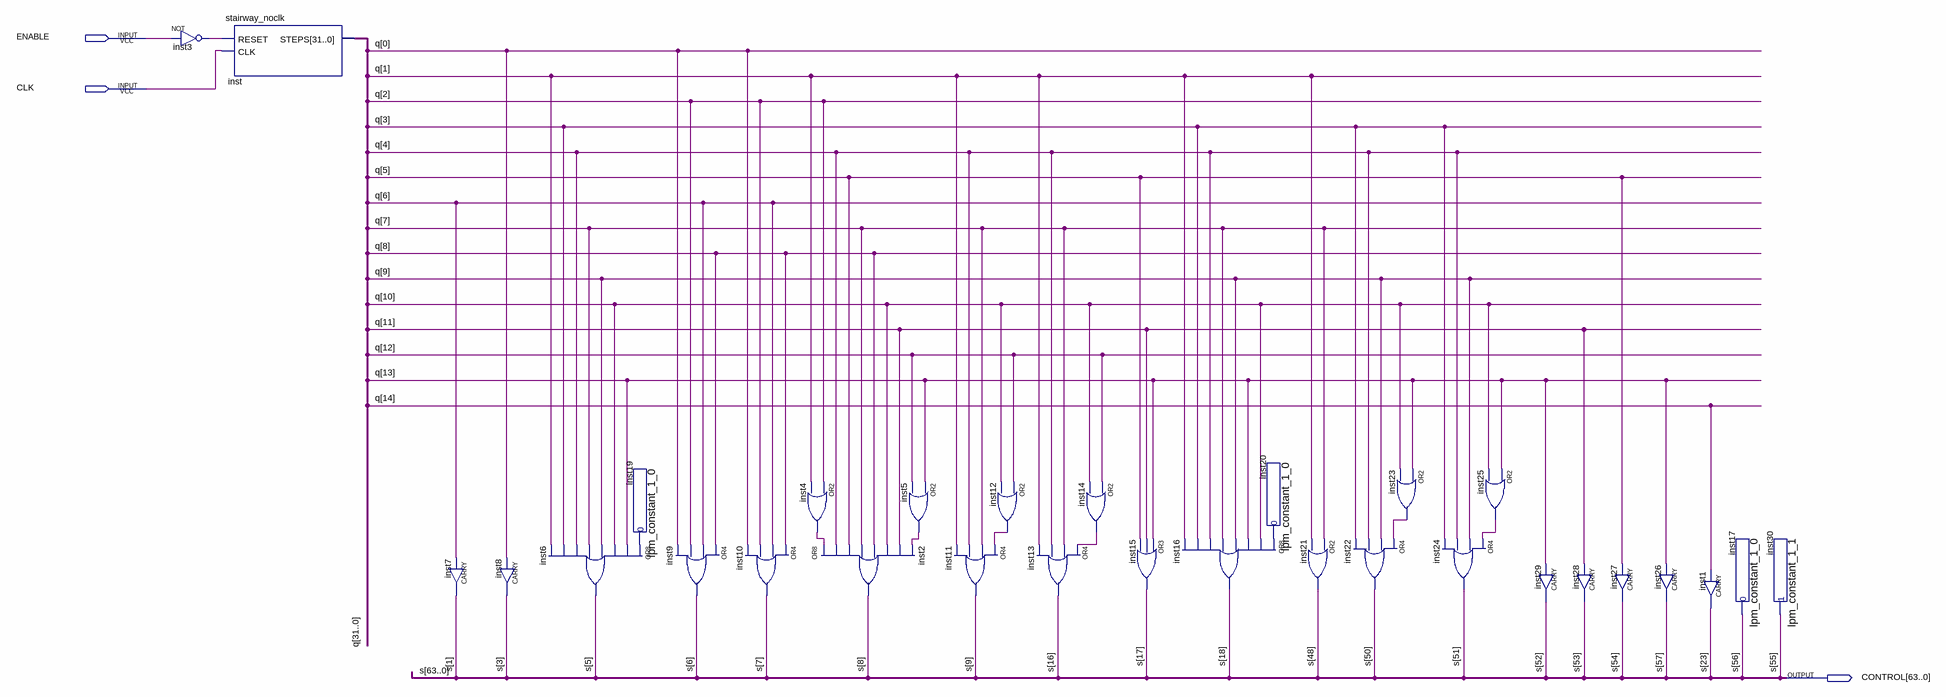
[diagram p0: schematic sheet]
// Quartus schematic macro_sub.bdf as structural Verilog: 30 symbols, 3 pins
module macro_sub (
  input  ENABLE,
  input  CLK,
  output [63:0] CONTROL
);

  wire inst3_out, inst4_out, inst5_out, inst12_out, inst14_out, inst19_result, inst20_result, inst23_out,
       inst25_out;
  wire [31:0] q;

  not inst3 (inst3_out, ENABLE);
  stairway_noclk inst (.RESET(inst3_out), .CLK(CLK), .STEPS(q));
  CARRY inst7 (.IN(q[6]), .OUT(CONTROL[1]));
  CARRY inst8 (.IN(q[0]), .OUT(CONTROL[3]));
  or inst6 (CONTROL[5], inst19_result, q[13], q[10], q[9], q[7], q[4], q[3], q[1]);
  lpm_constant_1_0 inst19 (.result(inst19_result));
  or inst9 (CONTROL[6], q[8], q[6], q[2], q[0]);
  or inst10 (CONTROL[7], q[8], q[6], q[2], q[0]);
  or inst4 (inst4_out, q[2], q[1]);
  or inst2 (CONTROL[8], inst4_out, q[4], q[5], q[7], q[8], q[10], q[11], inst5_out);
  or inst5 (inst5_out, q[13], q[12]);
  or inst12 (inst12_out, q[12], q[10]);
  or inst11 (CONTROL[9], inst12_out, q[7], q[4], q[1]);
  or inst13 (CONTROL[16], inst14_out, q[7], q[4], q[1]);
  or inst14 (inst14_out, q[12], q[10]);
  or inst15 (CONTROL[17], q[13], q[11], q[5]);
  or inst16 (CONTROL[18], inst20_result, q[10], q[13], q[9], q[7], q[4], q[3], q[1]);
  lpm_constant_1_0 inst20 (.result(inst20_result));
  or inst21 (CONTROL[48], q[7], q[1]);
  or inst22 (CONTROL[50], inst23_out, q[9], q[4], q[3]);
  or inst23 (inst23_out, q[13], q[10]);
  or inst24 (CONTROL[51], inst25_out, q[9], q[4], q[3]);
  or inst25 (inst25_out, q[13], q[10]);
  CARRY inst29 (.IN(q[13]), .OUT(CONTROL[52]));
  CARRY inst28 (.IN(q[11]), .OUT(CONTROL[53]));
  CARRY inst27 (.IN(q[5]), .OUT(CONTROL[54]));
  CARRY inst26 (.IN(q[13]), .OUT(CONTROL[57]));
  CARRY inst1 (.IN(q[14]), .OUT(CONTROL[23]));
  lpm_constant_1_0 inst17 (.result(CONTROL[56]));
  lpm_constant_1_1 inst30 (.result(CONTROL[55]));

  // Other names for the same wires on the sheet: s[63:0] = CONTROL
endmodule
